# EasyEDA Pro project 降压TPS5430.eprj

# Schematic Schematic1
Board Name: Board1; Create Date: 2025-10-13; Page Name: P1; Project Name: 降压TPS5430; Schematic Name: Schematic1; Update Date: 2025-10-13; Company: 嘉立创EDA; Page Size: A4; Version: V1.0
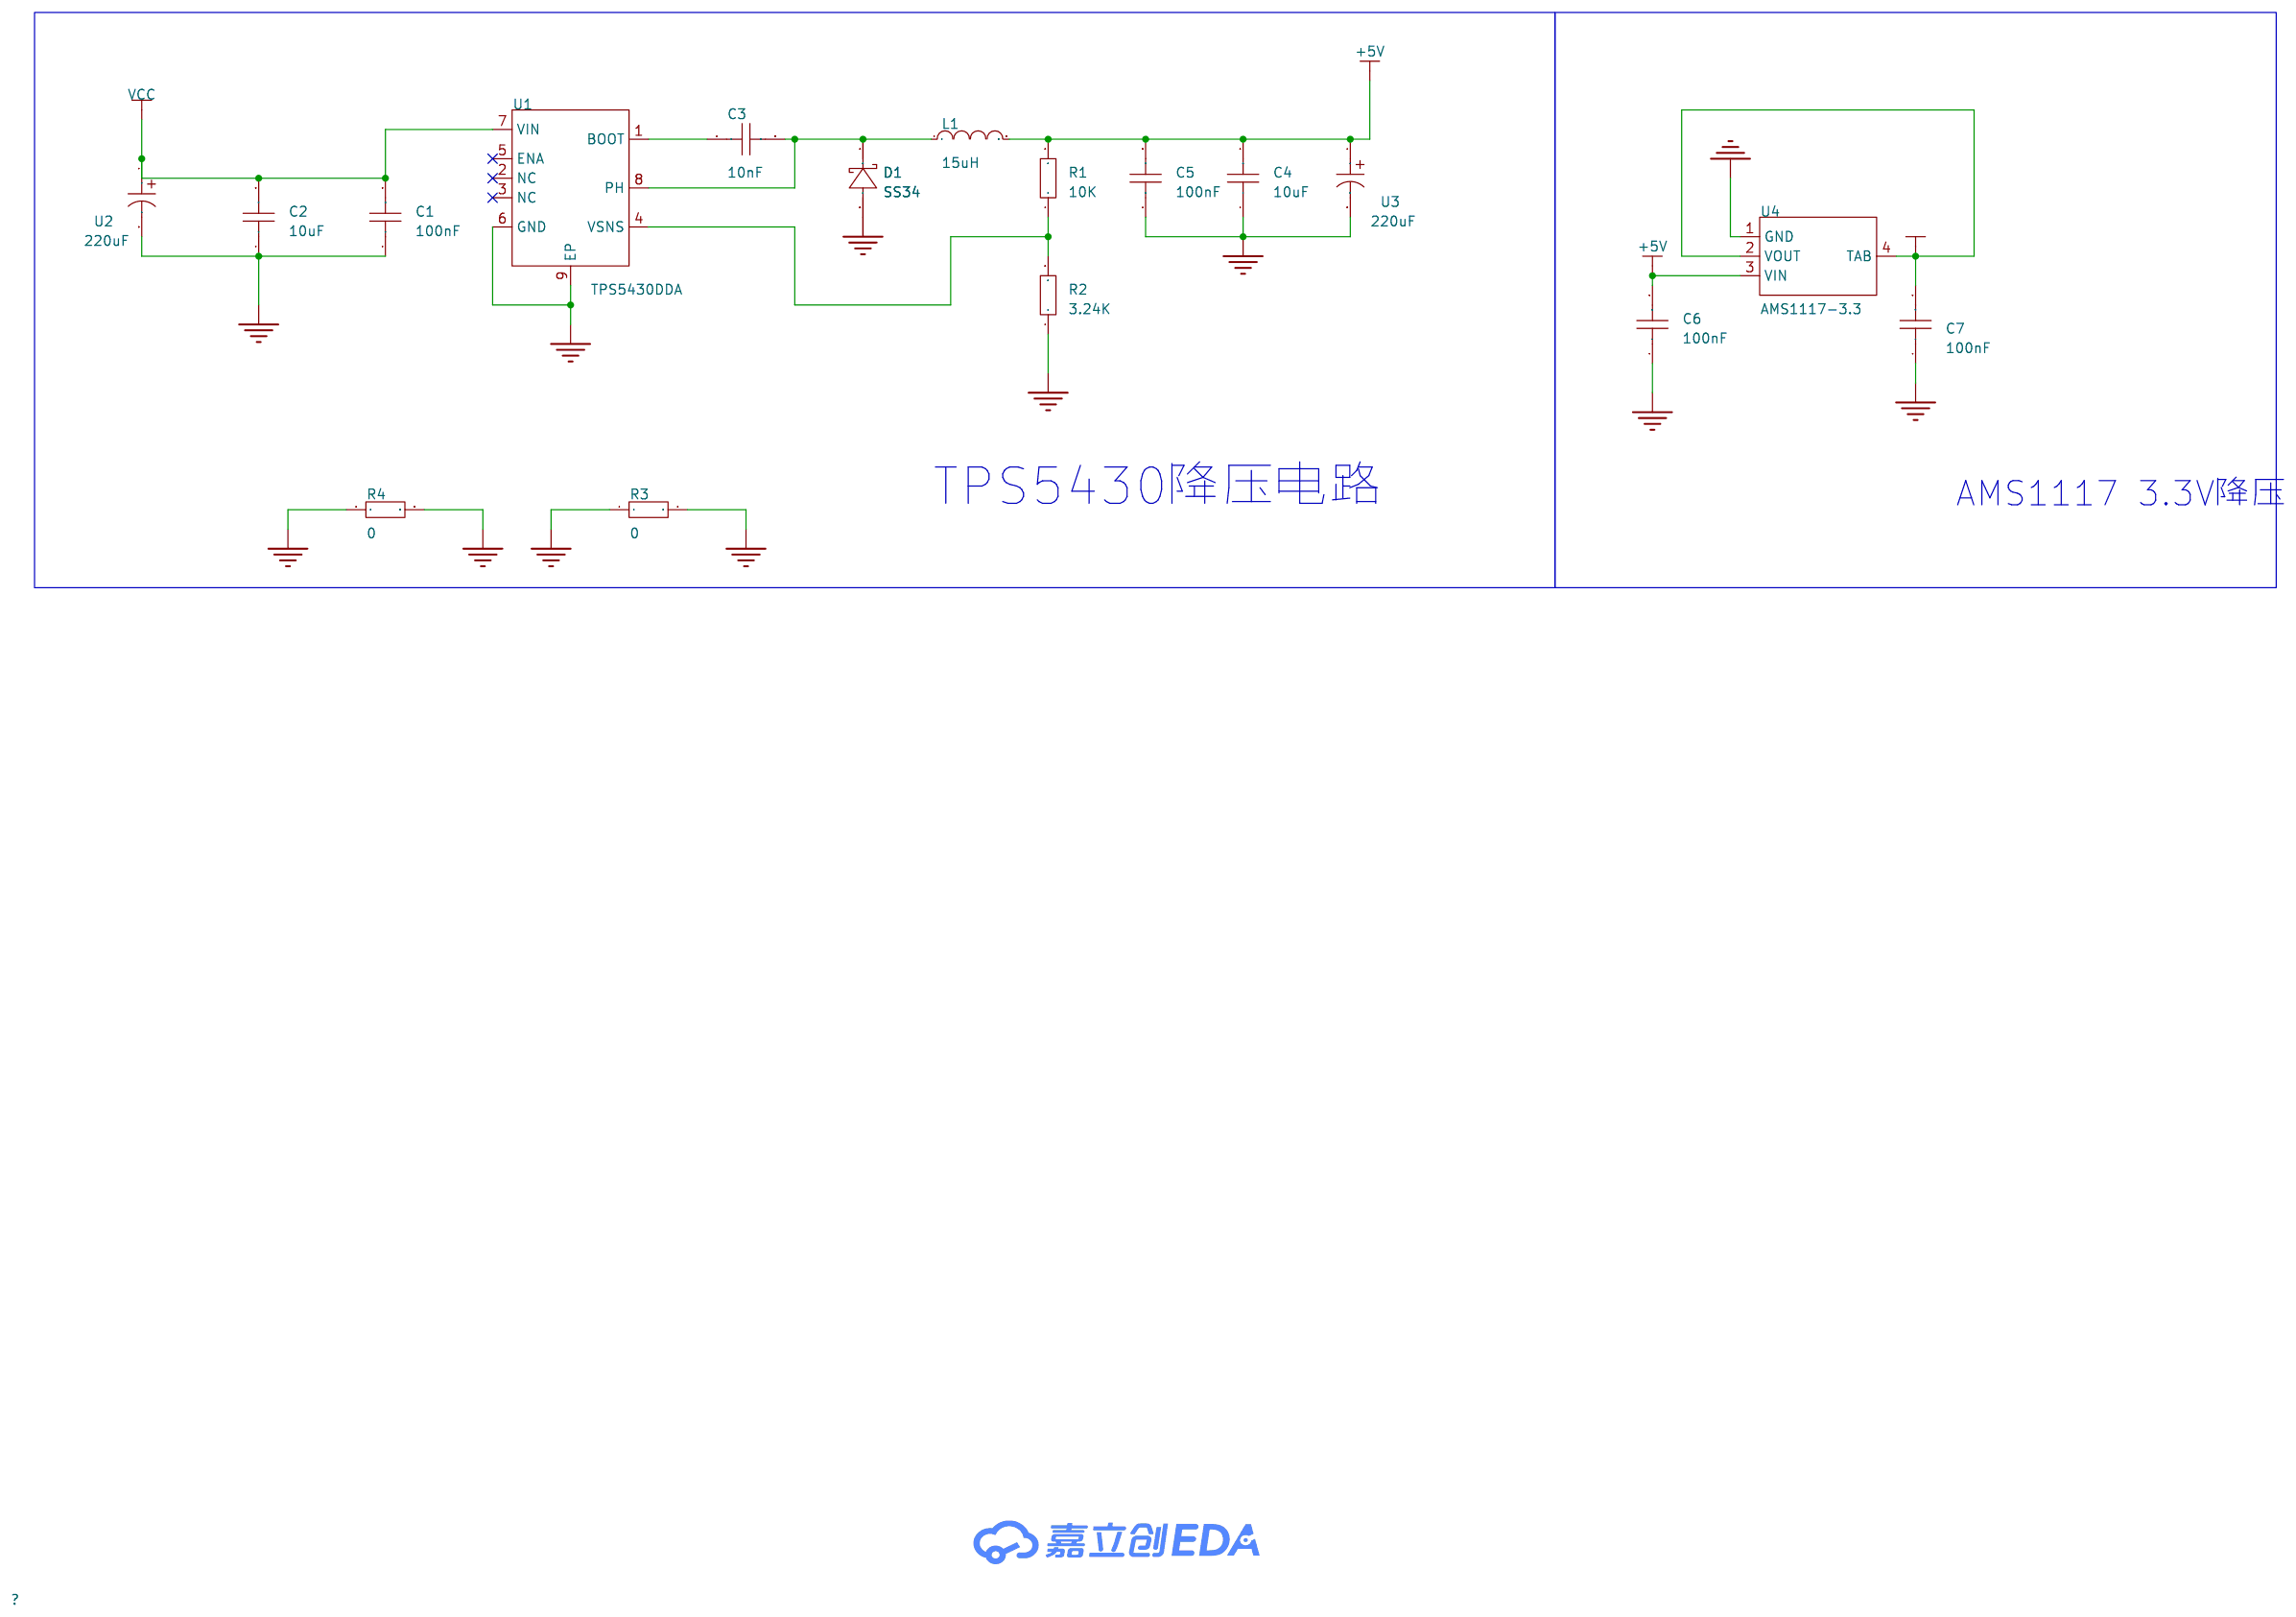
[diagram p0: schematic sheet]

## Parts
C1  100nF  [C0603]
C2  10uF  [C0603]
C3  10nF  [C0402]
C4  10uF  [C0603]
C5  100nF  [C0603]
C6  100nF  [C0402]
C7  100nF  [C0402]
D1  SS34  [SMA_L4.3-W2.5-LS5.0-RD]
L1  15uH  [IND-SMD_L7.0-W6.6_FXL0630]
R1  10K  [R0805]
R2  3.24K  [R0805]
R3  0  [R0805]
R4  0  [R0805]
U1  TPS5430DDA  [ESOP-8_L4.9-W3.9-P1.27-LS6.0-BL-EP-2]
U2  220uF  [CAP-TH_BD6.3-P2.50-D0.5-FD]
U3  220uF  [CAP-TH_BD6.3-P2.50-D0.5-FD]
U4  AMS1117-3.3  [SOT-223-3_L6.5-W3.5-P3.05-LS7.0]

## Library data of the parts
C1 C2 C4 C5 = CAP_0603: Supplier Footprint: 0603
C3 C6 C7 = CL05B104KB54PNC: LCSC Part Name: 100nF ±10% 50V; Supplier Part: C307331; Manufacturer: SAMSUNG(三星); Supplier Footprint: 0402; JLCPCB Part Class: Basic Part; Datasheet: https://item.szlcsc.com/datasheet/CL05B104KB54PNC/291005.html; Supplier: LCSC; Tolerance: ±10%; Voltage Rating: 50V; Temperature Coefficient: X7R
D1 = SS34_C727060: LCSC Part Name: 电压:40V 电流:3A; Supplier Part: C727060; Manufacturer: TWGMC(台湾迪嘉); Supplier Footprint: SMA(DO-214AC); JLCPCB Part Class: Extended Part; Datasheet: https://item.szlcsc.com/datasheet/SS34/774165.html; Supplier: LCSC; Diode Configuration: 独立式; Voltage - Forward(Vf@If): 550mV@3A; Voltage - DC Reverse(Vr): 40V; Current - Rectified: 3A; Reverse Leakage Current (Ir): 500uA; Operating Junction Temperature Range: -55℃~+125℃
L1 = FXL0630-150-M: LCSC Part Name: 15uH ±20%; Supplier Part: C177243; Manufacturer: cjiang(长江微电); Supplier Footprint: SMD,6.6x7mm; JLCPCB Part Class: Extended Part; Datasheet: https://item.szlcsc.com/datasheet/FXL0630-150-M/188635.html; Supplier: LCSC; Tolerance: ±20%; Current Rating: 3A; Current - Saturation(Isat): 4A; DC Resistance(DCR): 115mΩ; Type: 一体成型电感
R1-R4 = Res_0805: Supplier Footprint: 0805
U1 = TPS5430DDA: LCSC Part Name: 3A宽输入范围降压转换器; Supplier Part: C502477; Manufacturer: TI(德州仪器); Supplier Footprint: ESOP-8; JLCPCB Part Class: Extended Part; Datasheet: https://www.ti.com/cn/lit/gpn/tps5430; Supplier: LCSC; Function: 降压型; Output Type: 可调; Voltage - Supply: 5.5V~36V; Output Voltage: 1.221V~32.04V; Output Current: 3A; Frequency - Switching: 500kHz; Operating Temperature: -40℃~+125℃@(TJ); Synchronous Rectifier: 否; Number of Outputs: 1; Topology: 降压式; Switch tube (built-in/external): 内置
U2 U3 = KM1E221M0611: LCSC Part Name: 220uF ±20% 25V; Supplier Part: C2873972; Manufacturer: ROQANG(容强); Supplier Footprint: 插件; JLCPCB Part Class: Extended Part; Datasheet: https://atta.szlcsc.com/upload/public/pdf/source/20210825/43CC5C3A3C9845108B639C21E16A1224.pdf; Supplier: LCSC; Tolerance: ±20%; Voltage Rating: 25V; Ripple Current: 236mA@120kHz; Pin Spacing: 2.5mm; Lifetime: 2000hrs@105℃; Operating Temperature: -40℃~+105℃
U4 = AMS1117-3.3_C5250992: Supplier Part: C5250992; Manufacturer: TWGMC(迪嘉); Supplier Footprint: SOT-223-3L; JLCPCB Part Class: Extended Part; Datasheet: https://item.szlcsc.com/datasheet/AMS1117-3.3/5967328.html; Supplier: LCSC; Output Type: 固定; Voltage - Supply: 12V; Output Voltage: 3.3V; Output Current: 1A; Power Supply Rejection Ratio (PSRR): 70dB@(120Hz); Voltage Dropout: 1.4V@(1A); standby current: 3mA; Noise: 0.003%Vout; Features: 过热保护; Operating Temperature: -40℃~+125℃@(Tj); Output Configuration: 正极; Number of Outputs: 1

## Nets
+3.3V: C7.2 U4.2(VOUT) U4.4(TAB)
+5V: C4.2 C5.2 C6.2 L1.2 R1.2 U3.1 U4.3(VIN)
GND: C1.1 C2.1 C4.1 C5.1 C6.1 C7.1 D1.2(A) R2.1 R3.1 R3.2 R4.1 R4.2 U1.6(GND) U1.9(EP) U2.2 U3.2 U4.1(GND)
VCC: C1.2 C2.2 U1.7(VIN) U2.1
$1N949: C3.1 U1.1(BOOT)
$1N953: C3.2 D1.1(C) L1.1 U1.8(PH)
$1N1180: R1.1 R2.2 U1.4(VSNS)

Not connected (* = marked no-connect by the designer): U1 2(NC)* 3(NC)* 5(ENA)*

## Notes on the sheet
- TPS5430降压电路
- AMS1117 3.3V降压

# Board PCB1
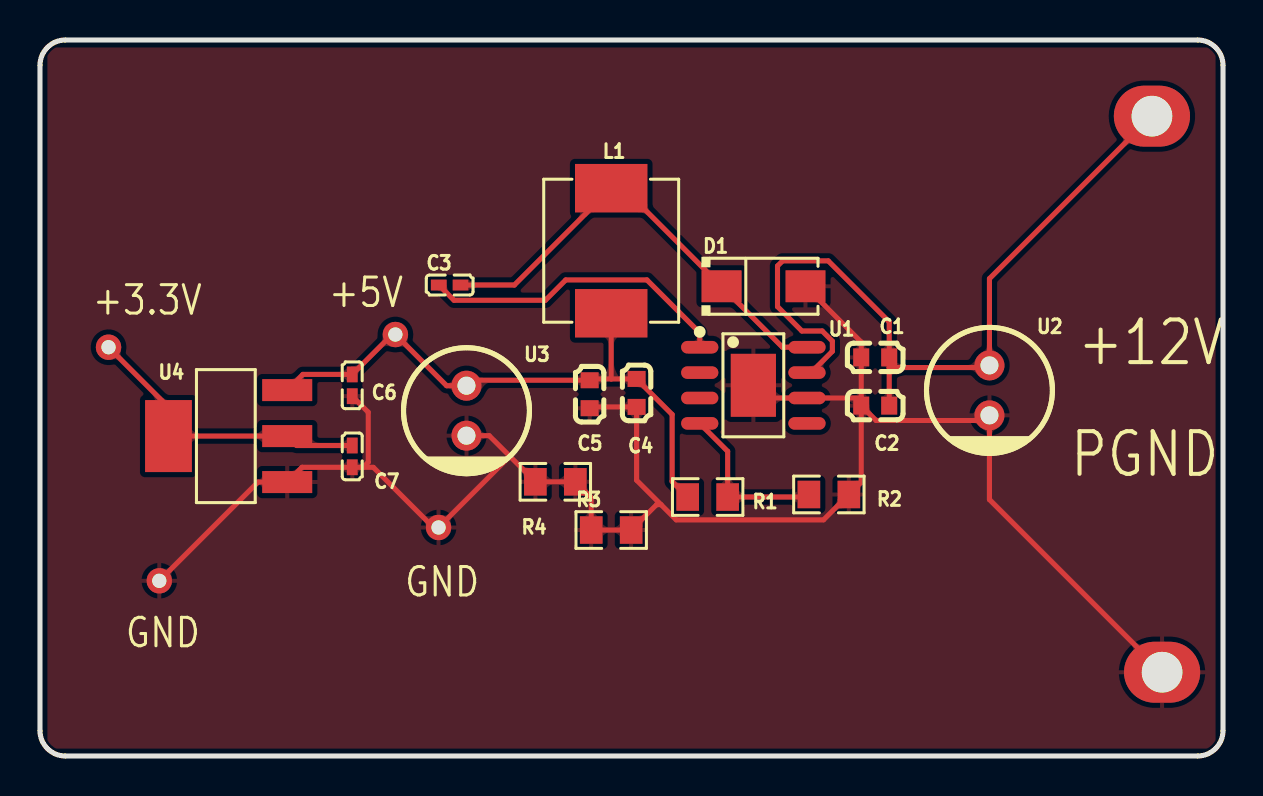
[diagram p1: board, top side]
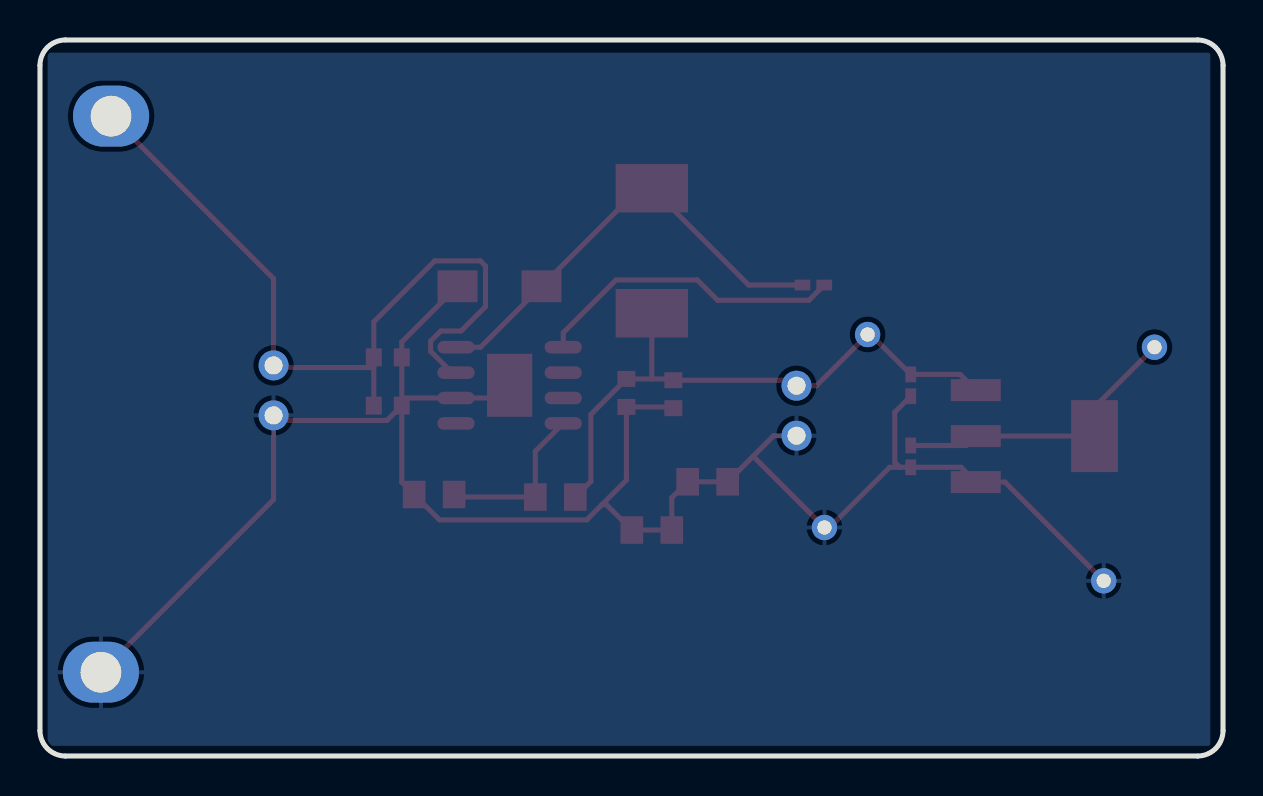
[diagram p2: board, bottom side, seen from below]

Outline 59.18 x 35.81 mm; copper layers: Top Layer, Bottom Layer. Coordinates in mm from the lower left corner of the outline.
Outline path: 0,34.54 0,1.27 arc(0.37,0.37) 1.27,0 57.91,0 arc(58.81,0.37) 59.18,1.27 59.18,34.54 arc(58.81,35.44) 57.91,35.81 1.27,35.81 arc(0.37,35.44) 0,34.54
Stack: Top Layer 0.035mm / Dielectric1 1.51mm FR4 er 4.5 / Bottom Layer 0.035mm

## Design rules (mm)
template: JLCPCB Capability(Two Layers Board)
spacing copperThickness1oz (default): track to track 0.102, other pairs 0.152 to 0.3
spacing copperThickness2oz: track to track 0.203, other pairs 0.152 to 0.3
track width copperThickness1oz (default): min 0.127, default 0.254, max 2.54
track width copperThickness2oz: min 0.203, default 0.254, max 2.54
differential pair differentialPair (default): width min 0.127, default 0.254, max 2.54; gap min 0.152, default 0.152
via viaSize (default): diameter min 0.5, default 0.61, max 10; hole min 0.3, default 0.305, max 6.3

## Placement (name value [footprint] x y rotation side)
C1  100nF  [C0603]  41.78 19.94 0 top
C2  10uF  [C0603]  41.78 17.53 0 top
C3  10nF  [C0402]  20.5 23.56 0 top
C4  10uF  [C0603]  29.85 18.16 90 top
C5  100nF  [C0603]  27.5 18.1 90 top
C6  100nF  [C0402]  15.62 18.54 90 top
C7  100nF  [C0402]  15.62 14.99 90 top
D1  SS34  [SMA_L4.3-W2.5-LS5.0-RD]  36.2 23.49 0 top
L1  15uH  [IND-SMD_L7.0-W6.6_FXL0630]  28.58 25.27 90 top
NOREF  -  [Pad_e395]  19.94 11.43 0 top
NOREF#2  -  [Pad_e393]  56.13 4.19 0 top
NOREF#3  -  [Pad_e392]  55.63 32 0 top
NOREF#4  -  [Pad_e394]  17.78 21.08 0 top
NOREF#5  -  [Pad_e400]  5.97 8.76 0 top
NOREF#6  -  [Pad_e397]  3.43 20.45 0 top
R1  10K  [R0805]  33.4 12.95 180 top
R2  3.24K  [R0805]  39.47 13.08 180 top
R3  0  [R0805]  28.58 11.3 0 top
R4  0  [R0805]  25.78 13.72 0 top
U1  TPS5430DDA  [ESOP-8_L4.9-W3.9-P1.27-LS6.0-BL-EP-2]  35.69 18.54 270 top
U2  220uF  [CAP-TH_BD6.3-P2.50-D0.5-FD]  47.5 18.29 270 top
U3  220uF  [CAP-TH_BD6.3-P2.50-D0.5-FD]  21.34 17.27 270 top
U4  AMS1117-3.3  [SOT-223-3_L6.5-W3.5-P3.05-LS7.0]  9.4 16 0 top

## Footprints (pads in the part's own frame, mm; a bottom-side part is the same pattern mirrored in y, then rotated)
C0402
  rect 0.79x0.54 smd: 1(-0.545,0) 2(0.545,0)
C0603
  rect 0.8x0.9 smd: 1(-0.7,0) 2(0.7,0)
CAP-TH_BD6.3-P2.50-D0.5-FD
  round 1.5 hole 0.9: 1(-1.25,0) 2(1.25,0)
ESOP-8_L4.9-W3.9-P1.27-LS6.0-BL-EP-2
  oval 0.63x1.865 smd: 1(-1.905,-2.683) 2(-0.635,-2.683) 3(0.635,-2.683) 4(1.905,-2.683) 5(1.905,2.683) 6(0.635,2.683) 7(-0.635,2.683) 8(-1.905,2.683)
  rect 3.15x2.26 smd: 9(0,0)
IND-SMD_L7.0-W6.6_FXL0630
  rect 2.424x3.62 smd: 1(3.128,0) 2(-3.128,0)
Pad_e392
  oval 3.81x3.048 hole 2.032: 1(0,0)
Pad_e393
  oval 3.81x3.048 hole 2.032: 2(0,0)
Pad_e394
  round 1.27 hole 0.711: 3(0,0)
Pad_e395
  round 1.27 hole 0.711: 4(0,0)
Pad_e397
  round 1.27 hole 0.711: 1(0,0)
Pad_e400
  round 1.27 hole 0.711: 1(0,0)
R0805
  rect 1.133x1.377 smd: 1(-1,0) 2(1,0)
SMA_L4.3-W2.5-LS5.0-RD
  rect 2x1.593 smd: 1(-2.1,0) 2(2.1,0)
SOT-223-3_L6.5-W3.5-P3.05-LS7.0
  rect 2.5x1.1 smd: 1(2.97,-2.3) 2(2.97,0) 3(2.97,2.3)
  rect 2.34x3.6 smd: 4(-2.97,0)

## Nets
+3.3V: C7.2 NOREF#6.1 U4.2 U4.4
+5V: C4.2 C5.2 C6.2 L1.2 NOREF#4.3 R1.2 U3.1 U4.3
GND: C1.1 C2.1 C4.1 C5.1 C6.1 C7.1 D1.2 NOREF.4 NOREF#2.2 NOREF#5.1 R2.1 R3.1 R3.2 R4.1 R4.2 U1.6 U1.9 U2.2 U3.2 U4.1
VCC: C1.2 C2.2 NOREF#3.1 U1.7 U2.1
$1N949: C3.1 U1.1
$1N953: C3.2 D1.1 L1.1 U1.8
$1N1180: R1.1 R2.2 U1.4

Pads without a net: U1 2 3 5

## Routing (per net, layer and track width the routed paths; a pad name or vN(x,y) marks a point on that pad's centre or on a via; arc(x,y) is an arc through that point)
+3.3V: length 15.1
  Top Layer w0.254: C7.2 12.84,15.53 U4.2 U4.4 6.43,17.45 NOREF#6.1
+5V: length 30.1
  Top Layer w0.254: 28.58,18.86 27.56,18.86 C5.2 21.61,18.8 U3.1 20.34,18.52 NOREF#4.3 17.62,21.08 C6.2 13.15,19.09 U4.3 ; 28.58,18.86 C4.2 31.62,17.08 31.62,13.73 R1.2 ; 28.58,18.86 L1.2
GND: length 98.5
  Top Layer w0.254: U3.2 22.48,16.02 23.51,14.99 ; NOREF#2.2 47.5,12.83 U2.2 47.24,16.78 41.83,16.78 C2.1 ; 31.07,12.57 31.83,11.81 39.2,11.81 R2.1 41.08,13.7 C2.1 ; 31.07,12.57 30.85,12.57 R3.2 R3.1 27.58,12.92 R4.2 R4.1 23.51,14.99 ; 31.07,12.57 29.85,13.79 29.85,17.46 27.56,17.46 C5.1 ; 23.51,14.99 23.5,14.99 NOREF.4 19.69,11.43 16.67,14.44 16.17,14.44 ; D1.2 41.08,20.71 C1.1 41.08,17.91 ; C2.1 41.08,17.91 ; 16.17,14.44 16.42,14.69 16.42,17.2 C6.1 ; 16.17,14.44 C7.1 13.11,14.44 U4.1 10.91,13.7 NOREF#5.1 ; U1.9 36.32,17.91 U1.6 41.08,17.91
VCC: length 39.8
  Top Layer w0.254: 42.48,19.43 47.39,19.43 U2.1 47.5,23.88 NOREF#3.1 ; 42.48,19.43 C1.2 42.48,21.72 39.44,24.76 37.15,24.76 36.89,24.51 36.89,22.48 38.12,21.26 39.13,21.26 39.64,20.75 39.64,20.24 38.74,19.34 38.54,19.34 U1.7 ; 42.48,19.43 C2.2
$1N949: length 15.6
  Top Layer w0.254: 19.95,23.56 20.71,22.8 25.28,22.8 26.3,23.81 30.36,23.81 33,21.17 U1.1
$1N953: length 22.6
  Top Layer w0.254: U1.8 37.14,20.45 D1.1 29.19,28.4 L1.1 23.73,23.56 C3.2
$1N1180: length 8.4
  Top Layer w0.254: R2.2 38.34,12.95 R1.1 34.4,15.24 U1.4

## Copper pours and planes (outline as drawn; the poured copper is in the pictures)
GND on Top Layer: 0.37,35.44 58.81,35.44 58.81,0.37 0.37,0.37
GND on Bottom Layer: 0.64,35.18 58.8,35.18 58.8,0.51 0.64,0.51

Small or netless copper shapes (teardrops, artwork), in the pictures only: 77 on Top Layer

## Text on the board
Top Silkscreen Layer: +3.3V | GND | +5V | PGND | +12V
